# Altium schematic sheet GPS.SchDoc
size A
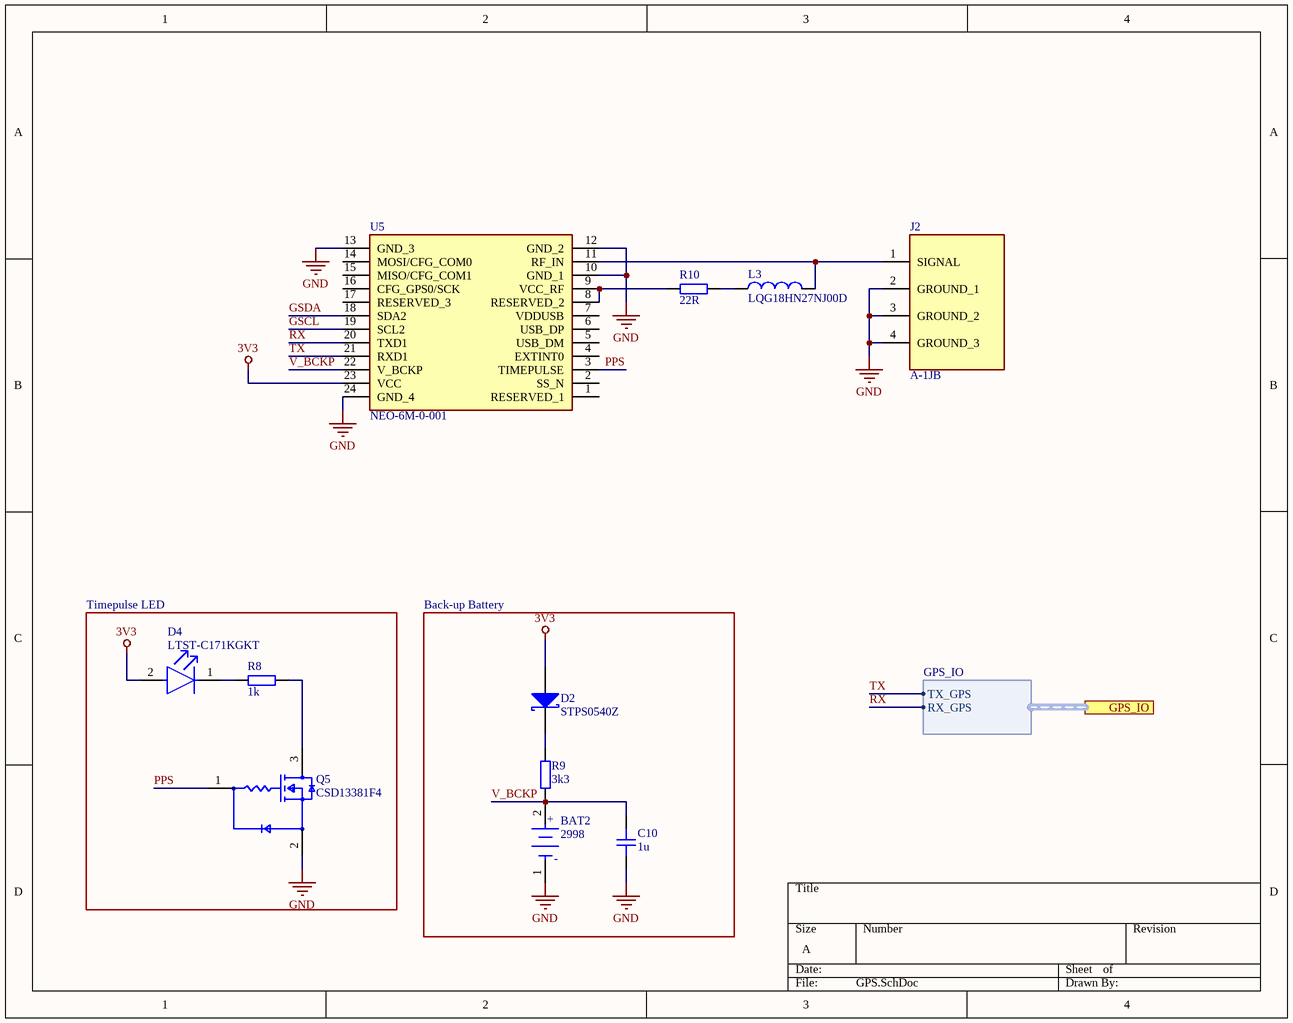
[diagram p0: GPS.SchDoc]

## Parts
BAT2  2998  [BAT_2998TR]
C10  1u  [CAP_0603]
D2  STPS0540Z  [STM-SOD-123-2_V]
D4  LTST-C171KGKT  [FP-LTST-C171KGKT-MFG]
J2  A-1JB  [A1JB]
L3  LQG18HN27NJ00D  [CAP_0603]
Q5  CSD13381F4  [FP-CSD13381F4-MFG]
R8  1k  [RES_0603]
R9  3k3  [RES_0603]
R10  22R  [RES_0603]
U5  NEO-6M-0-001  [NEO6M0001]

## Blocks framed on the sheet
Timepulse LED: D4 Q5 R8
Back-up Battery: BAT2 C10 D2 R9

## Ports
GPS_IO (harness GPS_IO)

## Harnesses
GPS_IO: TX_GPS, RX_GPS

## Nets
3V3: D2.1(A) D4.2(A) U5.23(VCC)
GND: BAT2.1(C) C10.1 J2.2(GROUND_1) J2.3(GROUND_2) J2.4(GROUND_3) Q5.2(S) U5.10(GND_1) U5.12(GND_2) U5.13(GND_3) U5.24(GND_4)
GSCL: U5.19(SCL2)
GSDA: U5.18(SDA2)
PPS: Q5.1(G) U5.3(TIMEPULSE)
RX: U5.20(TXD1) ; port GPS_IO.RX_GPS
TX: U5.21(RXD1) ; port GPS_IO.TX_GPS
V_BCKP: BAT2.2(A) C10.2 R9.1 U5.22(V_BCKP)
NetD2_2: D2.2(K) R9.2
NetD4_1: D4.1(C) R8.1
NetJ2_1: J2.1(SIGNAL) L3.2 U5.11(RF_IN)
NetL3_1: L3.1 R10.2
NetQ5_3: Q5.3(D) R8.2
NetR10_1: R10.1 U5.8(RESERVED_2) U5.9(VCC_RF)

Not connected (* = marked no-connect by the designer): U5 1(RESERVED_1) 2(SS_N) 4(EXTINT0) 5(USB_DM) 6(USB_DP) 7(VDDUSB) 14(MOSI/CFG_COM0) 15(MISO/CFG_COM1) 16(CFG_GPS0/SCK) 17(RESERVED_3)

## Notes on the sheet
- (in symbol 2998) +; -

## Library data of the parts
BAT2 = 2998: BATTERY RETAINER COIN 6.8MM SMD; Number of Batteries: 1; Package Quantity: 100; Mount: Surface Mount; Case/Package: SMD/SMT; Number of Cells: 1; REACH SVHC: No SVHC; Height: 2.9mm; Contact Material: Bronze; Material: Bronze; Lead Free: Lead Free; Termination: SMD/SMT; Color: Silver
C10 = CAP_0603: Ceramic Capacitor SMD 0603; Manufacturer: *; Manufacturer Part Number: *; Distributor Link: *; LCSC: *; Rating: *; Dielectric: *
D2 = CMP-2000-07170-1: Schottky Rectifier, 0.5 A, 40 V, 2-Pin SOP (SOD-123), RoHS, Tape and Reel; Manufacturer: STMicroelectronics; SVHC: NoSVHC(15-Jun-2015); Forward Current If(AV): 500mA; Forward Voltage VF Max: 500mV; Repetitive Reverse Voltage Vrrm Max: 40V; No. of Pins: 2Pins; Forward Surge Current Ifsm Max: 5.5A; Diode Configuration: Single; Packaging: CutTape; Datasheet Version: 01/2002; Package Reference: SOD-123-2; Package Description: 2-Pin Small Outline Diode, Body 2.7 x 1.55 mm; Manufacturer URL: http://www.st.com/; Mounting Technology: SurfaceMount; Product Range: -; Operating Temperature Max: 150°C; Diode Case Style: SOD-123; Diode Type: Schottky; Datasheet URL: http://www.st.com/content/ccc/resource/technical/document/datasheet/group1/0f/03/9b/7c/50/58/48/d7/CD00001852/files/CD00001852.pdf/jcr:content/translations/en.CD00001852.pdf
D4 = CMP-22017-000037-1: LED GREEN CLEAR SMD; Number of LEDs: 1; Viewing Angle: 130°; Lens Style: Rectangular; Dominant Wavelength: 571nm; Test Current: 20mA; Luminous Intensity: 35mcd; Power Rating: 75mW; Forward Voltage: 2.4V; Forward Current: 30mA; Reverse Voltage: 5V; Lens Color: Colorless; Wavelength: 574nm; Height: 0.8mm; Illumination Color: Green; Length: 2mm; Case/Package: 0805; Number of Pins: 2; Number of Elements: 1; Package Quantity: 1; Depth: 1.25mm; Lens Transparency: Clear; Width: 1.25mm; Color: Green; Radiation Hardening: No; Mount: Surface Mount; Packaging: Tape and Reel; Case Code (Metric): 2012; Lead Free: Lead Free; Max Operating Temperature: 85°C; Min Operating Temperature: -55°C; Case Code (Imperial): 0805; Power Dissipation: 75mW
J2 = A-1JB: U.FL (UMCC), AMC Connector Jack, Male Pin 50 Ohms Surface Mount Solder; Manufacturer_Name: Amphenol RF; Geometry.Height: 1.35mm; Manufacturer_Part_Number: A-1JB; Mouser Part Number: 523-A-1JB; Mouser Price/Stock: https://www.mouser.co.uk/ProductDetail/Amphenol-RF/A-1JB?qs=ncxkyCpAYDBidtvTkuzl1Q%3D%3D; Arrow Part Number: A-1JB; Arrow Price/Stock: https://www.arrow.com/en/products/a-1jb/amphenol-rf?utm_currency=USD&region=europe; Datasheet Link: https://s3-us-west-2.amazonaws.com/catsy.582/ca-1jb.pdf
L3 = LQG18HN27NJ00D: Ind RF Chip Multi-Layer 27nH 5% 100MHz 12Q-Factor Air 300mA 0603 Paper T/R; Package: None; Price: None; Value: *; MP: LQG18HN27NJ00D; Availability: Unavailable
Q5 = CMP-04962-000059-1: MOSFET N-CH 12V 2.1A 3PICOSTAR; Rise Time: 1.5ns; Gate to Source Voltage (Vgs): 8V; Max Power Dissipation: 500mW; Number of Elements: 1; Element Configuration: Single; Turn-Off Delay Time: 11ns; Turn-On Delay Time: 3.7ns; Drain to Source Resistance: 180mR; Input Capacitance: 200pF; Fall Time: 3.8ns; Number of Pins: 3; Drain to Source Breakdown Voltage: 12V; Package Quantity: 3000; Power Dissipation: 500mW; RoHS Compliant: Yes; Case/Package: QFN; Max Operating Temperature: 150°C; Mount: Surface Mount; Continuous Drain Current (ID): 2.1A; Drain to Source Voltage (Vdss): 12V; Number of Channels: 1; Rds On Max: 180mR; Packaging: Tape and Reel; Lead Free: Lead Free; Min Operating Temperature: -55°C
R8-R10 = RES_0603: Resistor SMD 0603; Manufacturer: *; Manufacturer Part Number: *; Distributor Link: *; LCSC: *
U5 = NEO-6M-0-001: GPS Module; Manufacturer_Name: u-blox; Geometry.Height: 2.6mm; Manufacturer_Part_Number: NEO-6M-0-001; Mouser Part Number: *; Mouser Price/Stock: *; Arrow Part Number: *; Arrow Price/Stock: *; Datasheet Link: https://www.u-blox.com/sites/default/files/products/documents/NEO-6_DataSheet_%28GPS.G6-HW-09005%29.pdf